# EAGLE schematic Water Sensor (EAGLE 8.7.0)
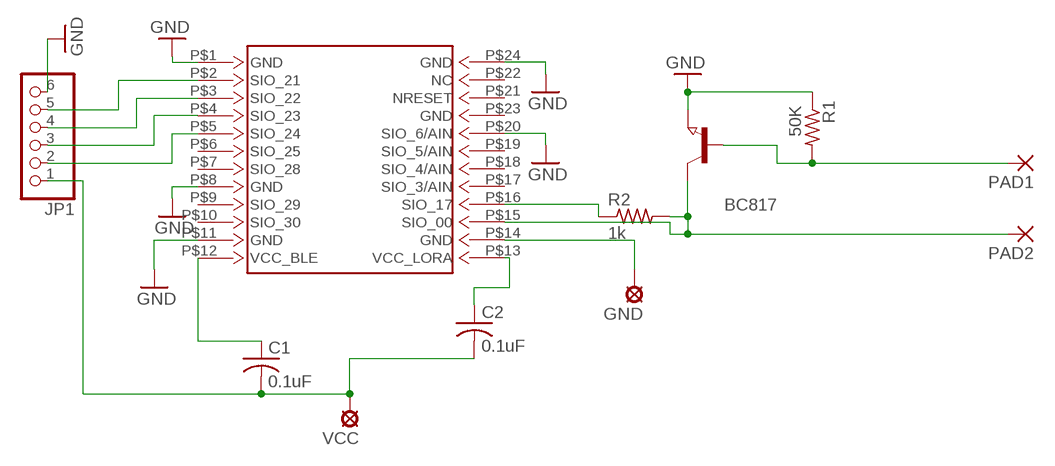
[diagram p0: schematic, sheet 1]

## Parts
BC817  NPN-TRANSISTOR_SOT23  [SOT23]
C1  0.1uF  C-USC0805  [C0805]
C2  0.1uF  C-USC0805  [C0805]
GND  SE13  [SE13]
JP1  PINHD-1X6  [1X06]
PAD1  SMD5  [SMD2,54-5,08]
PAD2  SMD5  [SMD2,54-5,08]
R1  50K  R-US_M0805  [M0805]
R2  1k  R-US_M0805  [M0805]
RM191  RM191RM1XX  [RM191]
VCC  SE13  [SE13]

## Nets
GND: BC817.2(E) GND.MP JP1.6 R1.1 RM191.P$1(GND) RM191.P$8(GND) RM191.P$11(GND) RM191.P$14(GND) RM191.P$20(SIO_6/AIN) RM191.P$24(GND)
N$1: JP1.5 RM191.P$2(SIO_21)
N$2: BC817.1(B) PAD1.1(P) R1.2
N$3: R2.1 RM191.P$16(SIO_17)
N$4: C2.1 RM191.P$13(VCC_LORA)
N$5: JP1.4 RM191.P$3(SIO_22)
N$6: BC817.3(C) PAD2.1(P) R2.2 RM191.P$15(SIO_00)
N$7: JP1.3 RM191.P$4(SIO_23)
N$9: JP1.2 RM191.P$5(SIO_24)
N$11: C1.1 RM191.P$12(VCC_BLE)
N$12: C1.2 C2.2 JP1.1 VCC.MP
Unconnected: RM191.P$6(SIO_25) RM191.P$7(SIO_28) RM191.P$9(SIO_29) RM191.P$10(SIO_30) RM191.P$17(SIO_3/AIN) RM191.P$18(SIO_4/AIN) RM191.P$19(SIO_5/AIN) RM191.P$21(NRESET) RM191.P$22(NC) RM191.P$23(GND)

## Library data of the parts
BC817 = semicon-smd-ipc:NPN-TRANSISTOR_: NPN TRANSISTOR
C1 C2 = rcl:C-US: CAPACITOR, American symbol; SPICEPREFIX: C
GND VCC = solpad:SE13: SOLDER PAD E1542, drill 1,3mm, distributor Buerklin, 07F815
JP1 = pinhead:PINHD-1X6: PIN HEADER
PAD1 PAD2 = wirepad:SMD5: SMD PAD
R1 R2 = rcl:R-US_: RESISTOR, American symbol; SPICEPREFIX: R
RM191 = MarAlert:RM191